# EAGLE design NMEA_BatteryMonitor (ESP32_D1_Mini) (EAGLE 9.6.2)
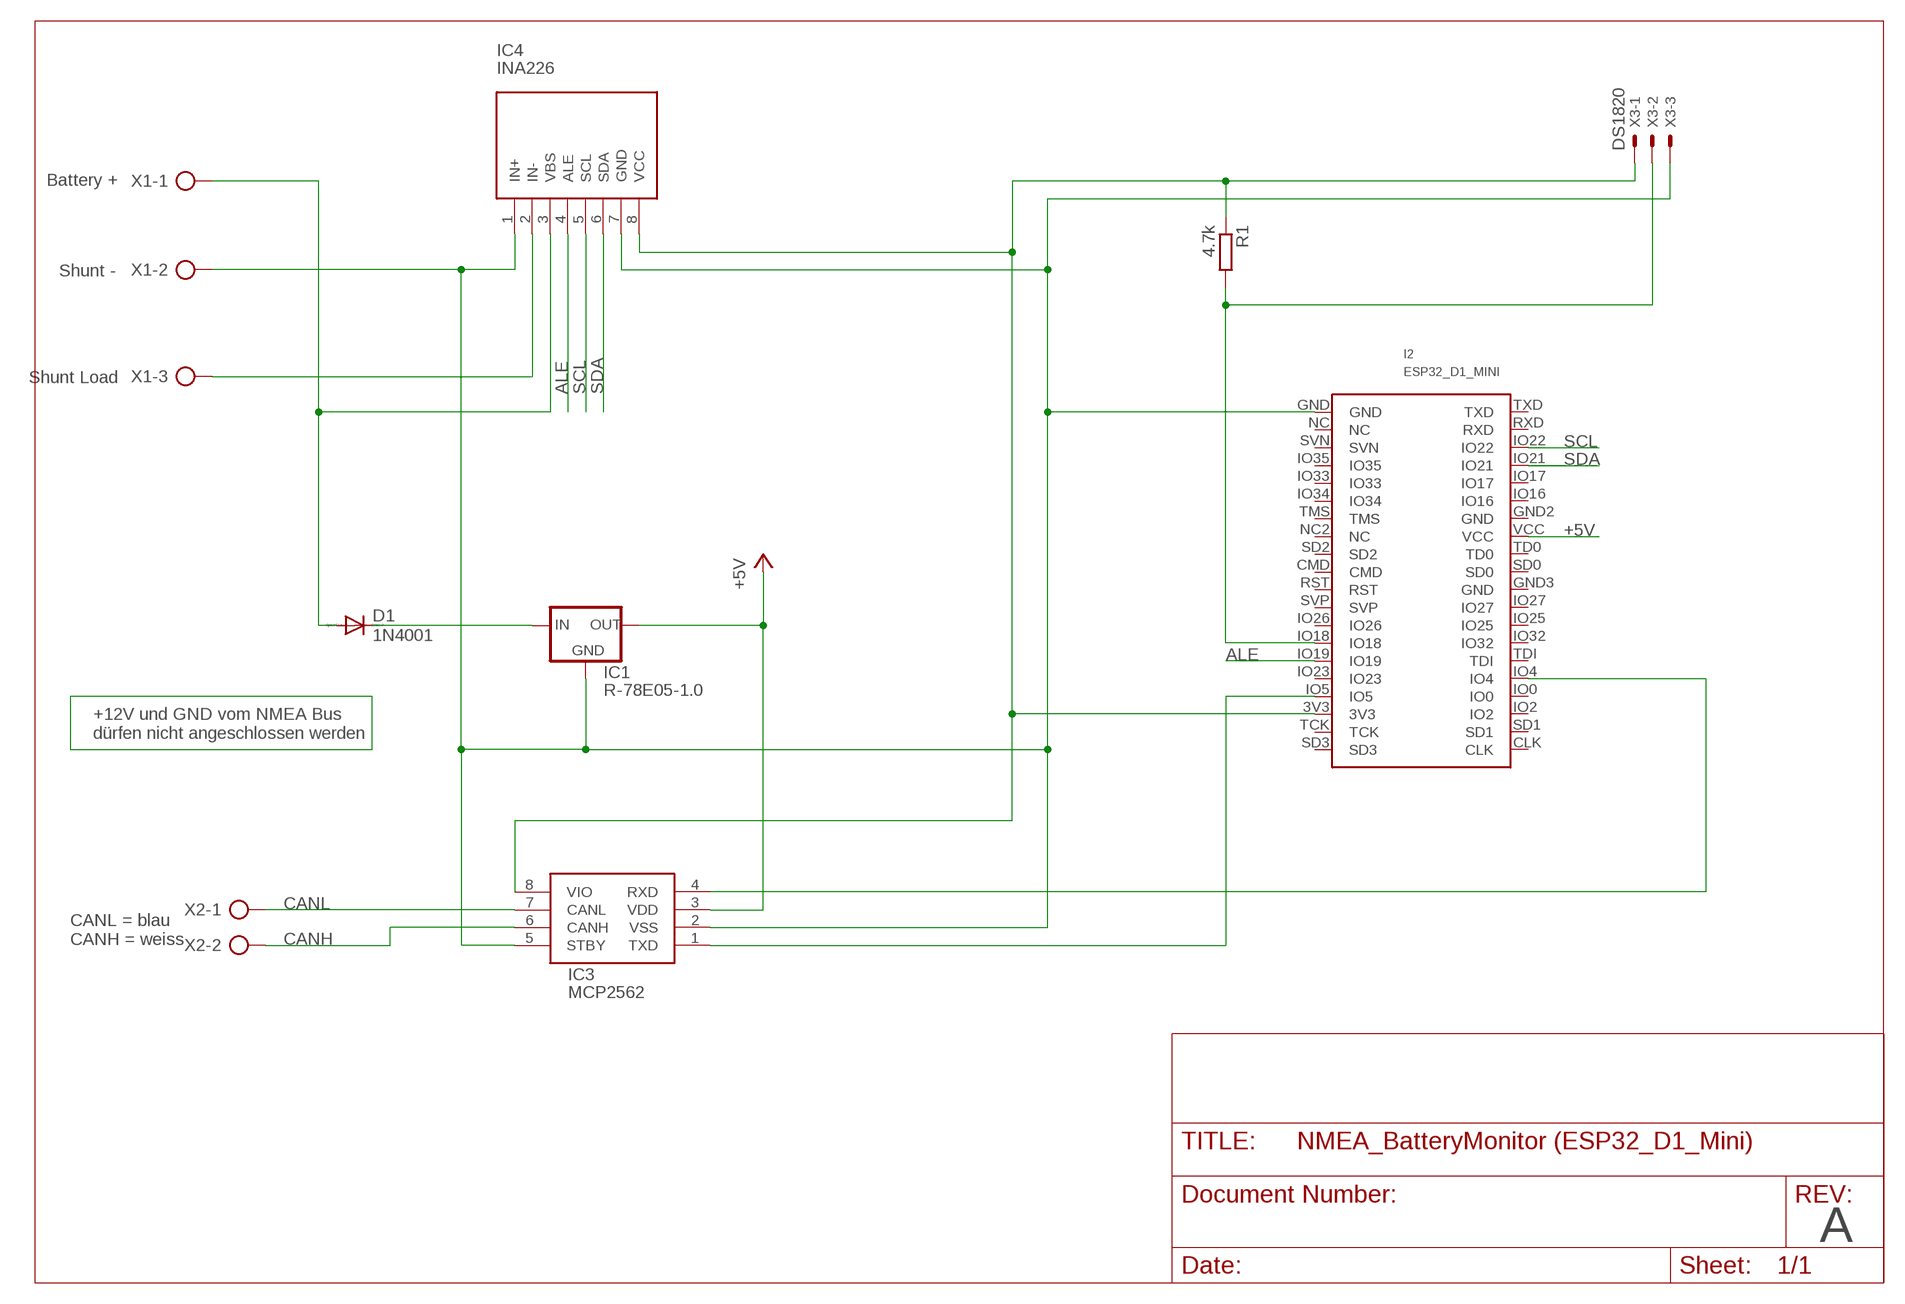
[diagram p0: schematic, sheet 1]

## Parts
D1  1N4001  1N4148  [SOD80]
I2  ESP32_D1_MINI  [ESP32_D1_MINI]
IC1  R-78E05-1.0  R-78E-XX1.0  [R-78E-XX1.0]
IC3  MCP2562  MCP2562SMD  [SO-8]
IC4  INA226  [INA226]
R1  4.7k  R-EU_R0805  [R0805]
X1  AK500/3  [AK500/3]
X2  AK500/2  [AK500/2]
X3  DS1820  22-23-2031  [22-23-2031]

## Nets
12V: D1.A IC4.3(VBS) X1.1
+5V: I2.VCC IC1.OUT IC3.3(VDD)
ALE: I2.IO19 IC4.4(ALE)
CANH: IC3.6(CANH) X2.2
CANL: IC3.7(CANL) X2.1
GND: I2.GND IC1.GND IC3.2(VSS) IC3.5(STBY) IC4.1(IN+) IC4.7(GND) X1.2 X3.3
LOAD: IC4.2(IN-) X1.3
N$1: I2.IO4 IC3.4(RXD)
N$2: I2.IO5 IC3.1(TXD)
N$6: I2.3V3 IC3.8(VIO) IC4.8(VCC) R1.1 X3.1
N$8: D1.C IC1.IN
N$9: I2.IO18 R1.2 X3.2
SCL: I2.IO22 IC4.5(SCL)
SDA: I2.IO21 IC4.6(SDA)
Unconnected: I2.CLK I2.CMD I2.GND2(GND) I2.GND3(GND) I2.IO0 I2.IO2 I2.IO16 I2.IO17 I2.IO23 I2.IO25 I2.IO26 I2.IO27 I2.IO32 I2.IO33 I2.IO34 I2.IO35 I2.NC I2.NC2(NC) I2.RST I2.RXD I2.SD0 I2.SD1 I2.SD2 I2.SD3 I2.SVN I2.SVP I2.TCK I2.TD0 I2.TDI I2.TMS I2.TXD

## Notes on the sheet
- Battery +
- Shunt -
- Shunt Load
- +12V und GND vom NMEA Bus 
  dürfen nicht angeschlossen werden
- CANL = blau
  CANH = weiss
- A

## Library data of the parts
D1 = _smd:1N4148: DIODE high speed (Philips)
I2 = _esp32:ESP32_D1_MINI
IC1 = _eigene:R-78E-XX1.0: VOLTAGE REGULATOR
IC3 = _eigene:MCP2562
IC4 = _eigene:INA226
R1 = rcl:R-EU_: RESISTOR, European symbol; SPICEPREFIX: R
X1 = con-ptr500:AK500/3: CONNECTOR; OC_FARNELL: unknown; OC_NEWARK: unknown
X2 = con-ptr500:AK500/2: CONNECTOR; OC_FARNELL: unknown; OC_NEWARK: unknown
X3 = con-molex:22-23-2031: .100" (2.54mm) Center Header - 3 Pin; MF: MOLEX; MPN: 22-23-2031; OC_FARNELL: 1462950; OC_NEWARK: 30C0862

## Board
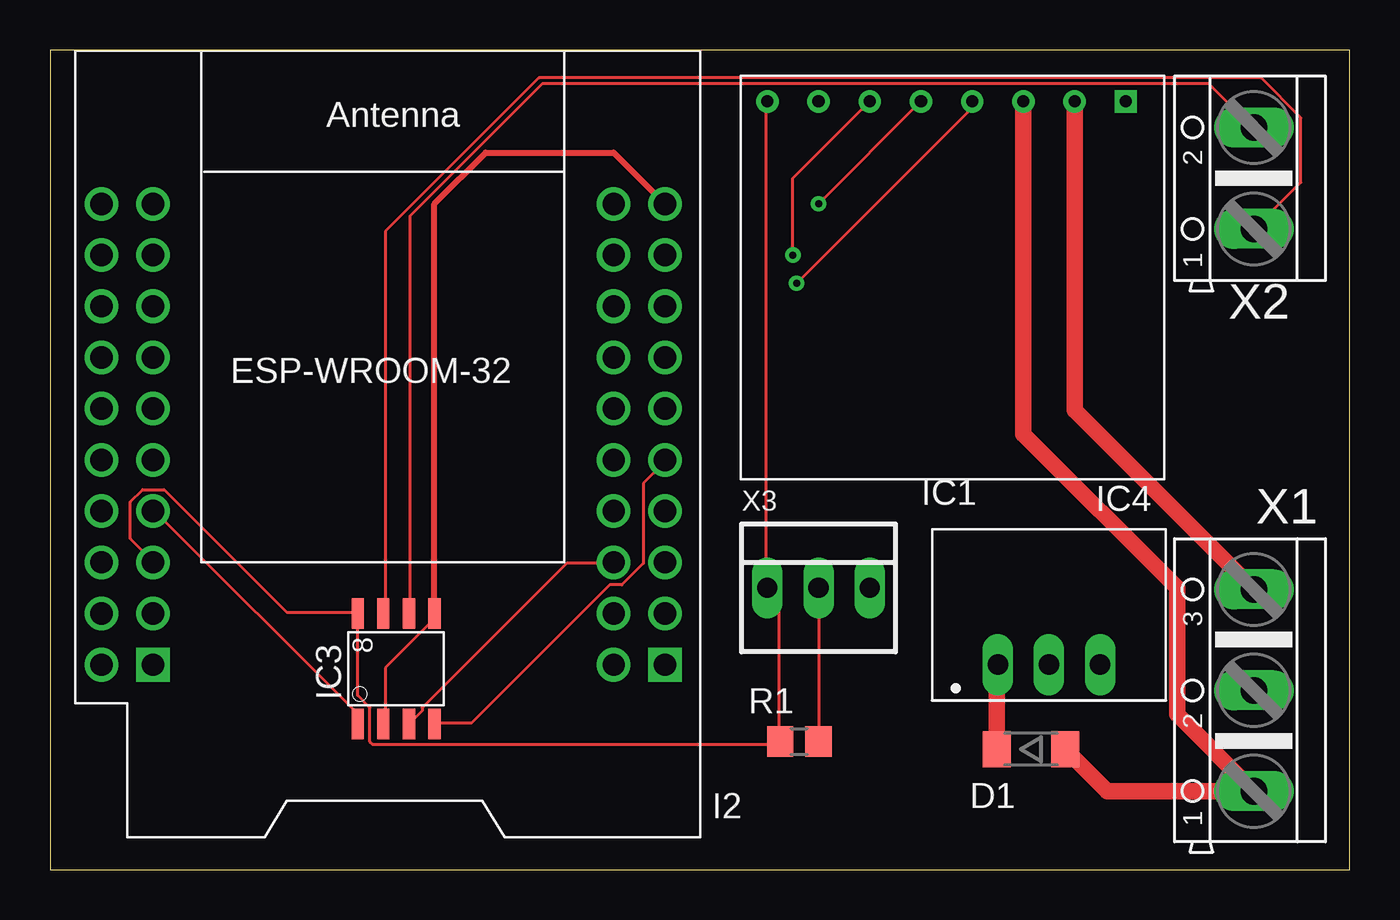
[diagram p1: board, top side]
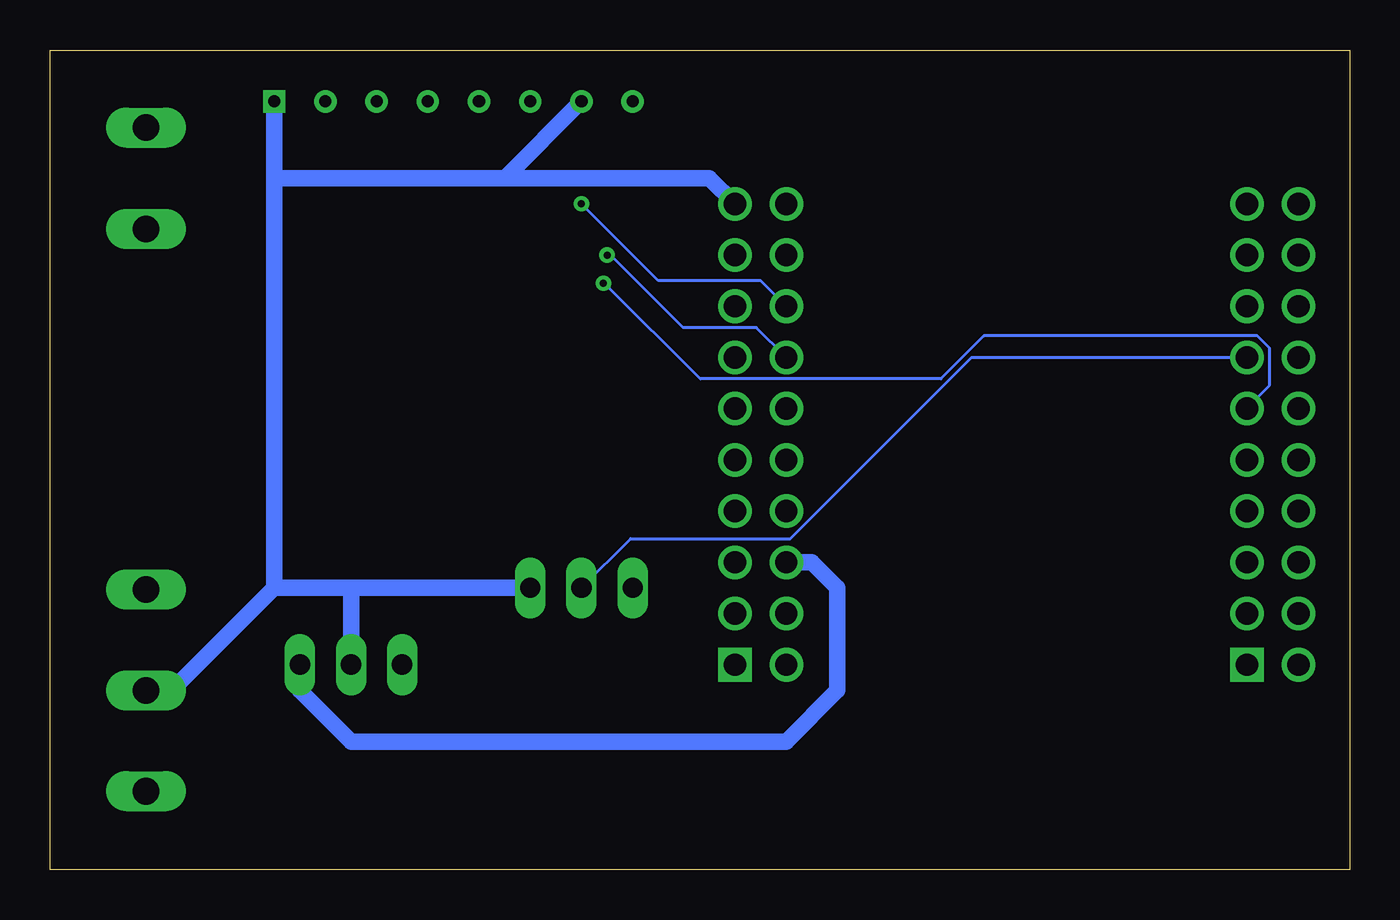
[diagram p2: board, bottom side, seen from below]

Size 64.44 x 40.63 mm. Coordinates in mm from the lower left corner, seen from the top.
Outline: 0,0 64.44,0 64.44,40.63 0,40.63 0,0
Copper layers (1*16): Top 0.035mm / dielectric 1.5mm / Bottom 0.035mm
Design rules "default": minimum track width 6mil, minimum drill 0.35mm, track to track 6mil, track to pad 6mil, pad to pad 6mil, via to via 6mil, smd to smd 6mil, copper to edge 40mil, drill to drill 6mil, minimum pad ring 10mil, minimum via ring 8mil, stop-mask expansion 4mil, vias tented up to drill 0mil, thermal gap 10mil

### Footprints (pad centres in the part's own frame; a part is rotated, then mirrored left to right if it is on the bottom)
SOD80 = smd 1.4 x 1.8: A 1.7,0; C -1.7,0
ESP32_D1_MINI = drill 1.11 pad 1.665: 3V3 25.4,-5.08; CMD 27.94,0; GND 0,-22.86; GND2 2.54,-7.62; GND3 27.94,-22.86; IO0 0,-7.62; IO2 0,-5.08; IO4 0,-10.16; IO5 25.4,-7.62; IO16 2.54,-10.16; IO17 2.54,-12.7; IO18 25.4,-15.24; IO19 25.4,-12.7; IO21 2.54,-15.24; IO22 2.54,-17.78; IO23 25.4,-10.16; IO25 0,-17.78; IO26 25.4,-17.78; IO27 0,-20.32; IO32 0,-15.24; IO33 27.94,-12.7; IO34 27.94,-10.16; IO35 27.94,-15.24; NC 27.94,-20.32; NC2 27.94,-5.08; RST 25.4,-22.86; RXD 2.54,-20.32; SD0 2.54,0; SD1 0,-2.54; SD2 27.94,-2.54; SVN 27.94,-17.78; SVP 25.4,-20.32; TCK 25.4,-2.54; TD0 2.54,-2.54; TDI 0,-12.7; TMS 27.94,-7.62; TXD 2.54,-22.86; VCC 2.54,-5.08 | drill 1.11 pad 1.665 square: CLK 0,0; SD3 25.4,0
R-78E-XX1.0 = drill 1.016 long: GND 0,-2.54; IN -2.54,-2.54; OUT 2.54,-2.54
SO-8 = smd 1.524 x 0.61: 1 -2.743,1.905; 2 -2.743,0.635; 3 -2.743,-0.635; 4 -2.743,-1.905; 5 2.743,-1.905; 6 2.743,-0.635; 7 2.743,0.635; 8 2.743,1.905
INA226 = drill 0.6 square: 1 1.27,1.27 | drill 0.6: 2 3.81,1.27; 3 6.35,1.27; 4 8.89,1.27; 5 11.43,1.27; 6 13.97,1.27; 7 16.51,1.27; 8 19.05,1.27
R0805 = smd 1.3 x 1.5: 1 -0.95,0; 2 0.95,0
AK500/3 = drill 1.321 long: 1 -5.004,0; 2 0,0; 3 5.004,0
AK500/2 = drill 1.321 long: 1 -2.515,0; 2 2.515,0
22-23-2031 = drill 1 long: 1 -2.54,0; 2 0,0; 3 2.54,0

### Placement (x,y rotation side)
D1  48.64,5.97 0 top
I2  30.48,10.16 180 top
IC1  49.53,12.7 0 top
IC3  17.14,9.96 90 top
IC4  54.61,39.37 180 top
R1  37.15,6.35 0 top
X1  59.69,8.89 90 top
X2  59.69,34.29 90 top
X3  38.1,13.97 0 top

### Tracks (layer width: path | path; a pad name or v marks a point on that pad's centre or on a via)
12V
  Top 0.813: D1.A 52.42,3.89 X1.1 55.88,7.7 55.88,13.97 48.26,21.59 IC4.3
+5V
  Top 0.152: IC3.3 18.44,7.87 18.44,8.03 25.6,15.19 27.89,15.19 I2.VCC
  Bottom 0.152: 51.97,10.16 IC1.OUT | 28.04,15.19 I2.VCC
  Bottom 0.813: IC1.OUT 52.07,8.89 49.53,6.35 27.94,6.35 25.4,8.89 25.4,13.97 26.67,15.24 I2.VCC
ALE  (via drill 0.35)
  Top 0.152: v37.01,29.08 45.72,37.8 IC4.4
  Bottom 0.152: v37.01,29.08 36.96,29.08 32.21,24.33 20.27,24.33 18.14,26.47 4.57,26.47 3.96,25.86 3.96,24.03 5.03,22.96 I2.IO19
CANH
  Top 0.152: IC3.6 17.83,12.75 17.83,32.41 24.38,38.96 57.45,38.96 59.59,36.83 X2.2
CANL
  Top 0.152: IC3.7 16.61,12.75 16.61,31.65 24.23,39.27 60.05,39.27 62.03,37.29 62.03,34.09 59.74,31.8 X2.1
GND
  Top 0.152: IC3.5 19.05,12.45 16.61,10.01 16.61,7.26 IC3.2
  Top 0.305: IC3.5 19.05,33.02 21.59,35.56 27.94,35.56 I2.GND
  Bottom 0.813: X3.3 49.53,13.97 | 49.53,13.97 53.34,13.97 | IC1.GND 49.53,13.97 | IC4.1 53.34,34.29 | 53.34,34.29 53.34,13.97 | IC4.7 41.91,34.29 | 41.91,34.29 53.34,34.29 | I2.GND 31.75,34.29 41.91,34.29 | X1.2 58.42,8.89 53.34,13.97
LOAD
  Top 0.813: X1.3 50.8,22.78 IC4.2
N$1
  Top 0.152: IC3.4 19.05,7.26 20.88,7.26 27.74,14.12 28.35,14.12 29.41,15.19 29.41,19.15 30.48,20.22 I2.IO4
N$2
  Top 0.152: IC3.1 15.24,7.72 5.18,17.78 I2.IO5
N$6
  Top 0.152: I2.3V3 5.03,15.34 3.96,16.41 3.96,18.24 4.57,18.85 5.64,18.85 11.73,12.75 15.24,12.75 IC3.8 15.24,8.64 15.85,8.03 15.85,6.35 16,6.2 35.97,6.2 36.12,6.35 | 36.12,6.35 36.12,13.51 35.66,13.97 X3.1 35.51,13.97 35.51,38.05 IC4.8 | 36.12,6.35 R1.1
N$8
  Top 0.813: D1.C 46.94,10.11 IC1.IN
N$9
  Top 0.152: X3.2 R1.2
  Bottom 0.152: I2.IO18 18.75,25.4 27.74,16.41 35.66,16.41 X3.2
SCL  (via drill 0.35)
  Top 0.152: v38.1,33.02 IC4.5
  Bottom 0.152: I2.IO22 29.21,29.21 34.29,29.21 v38.1,33.02
SDA  (via drill 0.35)
  Top 0.152: v36.83,30.48 36.83,34.29 IC4.6
  Bottom 0.152: I2.IO21 29.42,26.88 33.05,26.88 36.65,30.48 v36.83,30.48